# Altium schematic sheet MCU.SchDoc: MCU
size A4; Organization: Zigman NIkita; Address3: zigman.nikita@gmail.com; DocumentNumber: 1.0; Revision: ZN; SheetNumber: 2; SheetTotal: 6
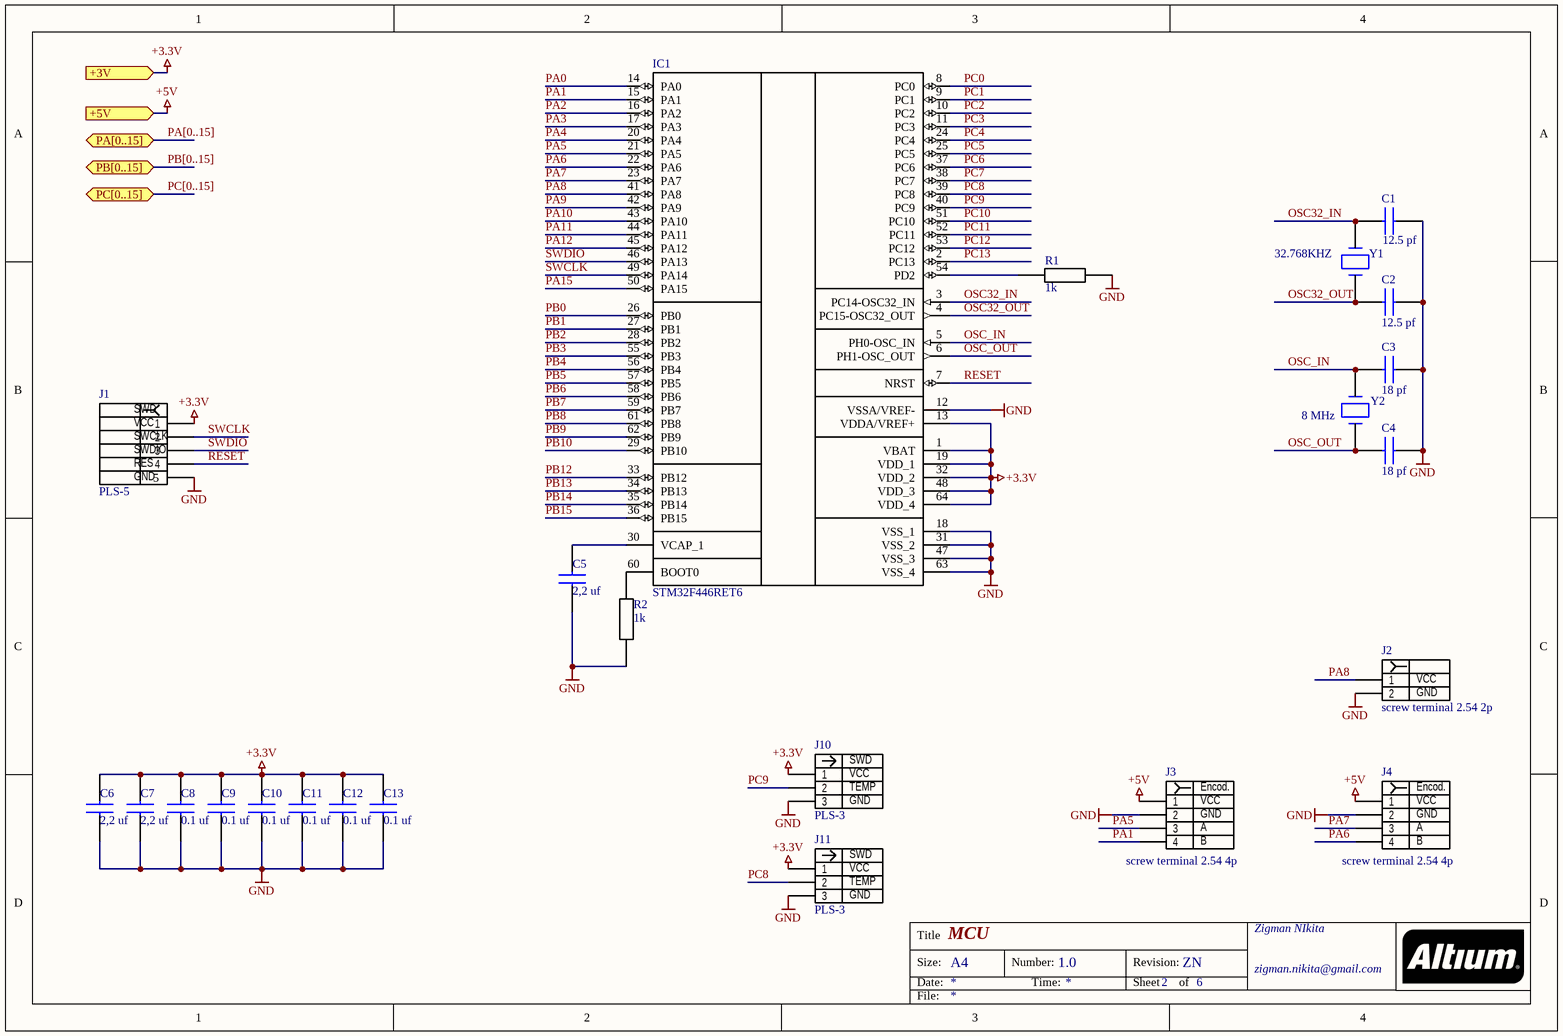
[diagram p0: MCU.SchDoc]

## Parts
C1  12.5 pf  [CAPC1608X90N]
C2  12.5 pf  [CAPC1608X90N]
C3  18 pf  [CAPC1608X90N]
C4  18 pf  [CAPC1608X90N]
C5  2,2 uf  [CAPC1608X90N]
C6  2,2 uf  [CAPC1608X90N]
C7  2,2 uf  [CAPC1608X90N]
C8  0.1 uf  [CAPC1608X90N]
C9  0.1 uf  [CAPC1608X90N]
C10  0.1 uf  [CAPC1608X90N]
C11  0.1 uf  [CAPC1608X90N]
C12  0.1 uf  [CAPC1608X90N]
C13  0.1 uf  [CAPC1608X90N]
IC1  STM32F446RET6  [QFP50P1200X1200X160-64N]
J1  PLS-5  [TE_826646-5]
J2  screw terminal 2.54 2p  [1725672-2-2.54]
J3  screw terminal 2.54 4p  [1725672-4-2.54]
J4  screw terminal 2.54 4p  [1725672-4-2.54]
J10  PLS-3  [TE_826646-3]
J11  PLS-3  [TE_826646-3]
R1  1k  [RESC1608X55N]
R2  1k  [RESC1608X55N]
Y1  32.768KHZ  [9HT1132768KDZBT]
Y2  8 MHz  [ABM2]

## Ports
+3V (in), +5V (in), PA[0..15] (bidir), PB[0..15] (bidir), PC[0..15] (bidir)

## Nets
+3.3V: C6.2 C7.2 C8.2 C9.2 C10.2 C11.2 C12.2 C13.2 IC1.1(VBAT) IC1.13(VDDA/VREF+) IC1.19(VDD_1) IC1.32(VDD_2) IC1.48(VDD_3) IC1.64(VDD_4) J1.1 J10.1 J11.1 ; port +3V
+5V: J3.1 J4.1 ; port +5V
GND: C1.1 C2.1 C3.1 C4.1 C5.1 C6.1 C7.1 C8.1 C9.1 C10.1 C11.1 C12.1 C13.1 IC1.12(VSSA/VREF-) IC1.18(VSS_1) IC1.31(VSS_2) IC1.47(VSS_3) IC1.63(VSS_4) J1.5 J2.2 J3.2 J4.2 J10.3 J11.3 R1.1 R2.2
OSC32_IN: C1.2 IC1.3(PC14-OSC32_IN) Y1.2
OSC32_OUT: C2.2 IC1.4(PC15-OSC32_OUT) Y1.1
OSC_IN: C3.2 IC1.5(PH0-OSC_IN) Y2.2
OSC_OUT: C4.2 IC1.6(PH1-OSC_OUT) Y2.1
PA0: IC1.14(PA0)
PA1: IC1.15(PA1) J3.4
PA2: IC1.16(PA2)
PA3: IC1.17(PA3)
PA4: IC1.20(PA4)
PA5: IC1.21(PA5) J3.3
PA6: IC1.22(PA6) J4.4
PA7: IC1.23(PA7) J4.3
PA8: IC1.41(PA8) J2.1
PA9: IC1.42(PA9)
PA10: IC1.43(PA10)
PA11: IC1.44(PA11)
PA12: IC1.45(PA12)
PA15: IC1.50(PA15)
PB0: IC1.26(PB0)
PB1: IC1.27(PB1)
PB2: IC1.28(PB2)
PB3: IC1.55(PB3)
PB4: IC1.56(PB4)
PB5: IC1.57(PB5)
PB6: IC1.58(PB6)
PB7: IC1.59(PB7)
PB8: IC1.61(PB8)
PB9: IC1.62(PB9)
PB10: IC1.29(PB10)
PB12: IC1.33(PB12)
PB13: IC1.34(PB13)
PB14: IC1.35(PB14)
PB15: IC1.36(PB15)
PC0: IC1.8(PC0)
PC1: IC1.9(PC1)
PC2: IC1.10(PC2)
PC3: IC1.11(PC3)
PC4: IC1.24(PC4)
PC5: IC1.25(PC5)
PC6: IC1.37(PC6)
PC7: IC1.38(PC7)
PC8: IC1.39(PC8) J11.2
PC9: IC1.40(PC9) J10.2
PC10: IC1.51(PC10)
PC11: IC1.52(PC11)
PC12: IC1.53(PC12)
PC13: IC1.2(PC13)
RESET: IC1.7(NRST) J1.4
SWCLK: IC1.49(PA14) J1.2
SWDIO: IC1.46(PA13) J1.3
NetC5_2: C5.2 IC1.30(VCAP_1)
NetIC1_54: IC1.54(PD2) R1.2
NetIC1_60: IC1.60(BOOT0) R2.1

## Buses and harness runs
bus PA[0..15] = port PA[0..15]
bus PB[0..15] = port PB[0..15]
bus PC[0..15] = port PC[0..15]

## Notes on the sheet
- Title
- Size:
- Date:
- A4
- Number:
- Time:
- Revision:
- Sheet
- of
- File:
- (in symbol PLS-3) SWD; VCC; TEMP; GND
- (in symbol PLS-5) SWD; VCC; SWCLK; SWDIO; RES; GND
- (in symbol screw terminal 2.54 2p) VCC; GND
- (in symbol screw terminal 2.54 4p) Encod.; VCC; GND; A; B

## Library data of the parts
C1-C4 = 0603: AVX 18pF 200V dc 0603; Datasheet Link: https://at.rs-online.com/web/p/keramik-vielschichtkondensatoren/6983970/; Height: 0.9mm; Manufacturer_Name: AVX
C5-C7 = 0603: Murata 2.2 uF X7R 10% 10V dc 0603; Manufacturer_Part_Number: 06033C393JAT2A; Datasheet Link: https://at.rs-online.com/web/p/keramik-vielschichtkondensatoren/7235597/; Height: 0.9mm; Manufacturer_Name: Murata
C8-C13 = 0603: AVX 0.1 uF 16v dc 0603; Datasheet Link: https://at.rs-online.com/web/p/keramik-vielschichtkondensatoren/1358340/; Height: 0.9mm; Manufacturer_Name: AVX
IC1 = STM32F446RET6: Integrated Circuit; Manufacturer_Name: STMicroelectronics; Datasheet Link: http://docs-emea.rs-online.com/webdocs/14d7/0900766b814d7c59.pdf; Height: 1.6mm; Manufacturer_Part_Number: STM32F446RET6; Arrow Part Number: STM32F446RET6; Arrow Price/Stock: https://www.arrow.com/en/products/stm32f446ret6/stmicroelectronics; Mouser Part Number: 511-STM32F446RET6; Mouser Price/Stock: https://www.mouser.co.uk/ProductDetail/STMicroelectronics/STM32F446RET6?qs=Ok1pvOkw6%2FqpQsWf8F4wtQ%3D%3D
J1 = PLS-5: Board-To-Board Connector, Through Hole, Header, 5, 2.54 mm, Gold Plated Contacts; MF: TE Connectivity; MP: 826646-5; SnapEDA_Link: https://www.snapeda.com/parts/826646-5/TE%20Connectivity%20AMP%20Connectors/view-part/2389611/?ref=snap; TE_purchase_URL: https://www.te.com/usa-en/product-826646-5.html?te_bu=Cor&te_type=disp&te_campaign=seda_glo_cor-seda-global-disp-prtnr-fy19-seda-model-bom-cta_sma-317_1&elqCampaignId=32493; Availability: Unavailable; Value: *; EU_RoHS_Compliance: Compliant; Price: None; Package: None
J2 = screw terminal 2.54 2p: Connector; Manufacturer_Name: Phoenix Contact; Manufacturer_Part_Number: 1725672; Datasheet Link: https://www.phoenixcontact.com/online/portal/us?uri=pxc-oc-itemdetail:pid=1725672&library=usen&tab=1.pdf; Arrow Part Number: 1725672; Arrow Price/Stock: https://www.arrow.com/en/products/1725672/phoenix-contact; Mouser Part Number: 651-1725672; Mouser Price/Stock: https://www.mouser.co.uk/ProductDetail/Phoenix-Contact/1725672?qs=Ul7CXFMnlWXX93F9bOV2pQ%3D%3D
J3 J4 = screw terminal 2.54 4p: Connector; Manufacturer_Name: Phoenix Contact; Manufacturer_Part_Number: 1725672; Datasheet Link: https://www.phoenixcontact.com/online/portal/us?uri=pxc-oc-itemdetail:pid=1725672&library=usen&tab=1.pdf; Arrow Part Number: 1725672; Arrow Price/Stock: https://www.arrow.com/en/products/1725672/phoenix-contact; Mouser Part Number: 651-1725672; Mouser Price/Stock: https://www.mouser.co.uk/ProductDetail/Phoenix-Contact/1725672?qs=Ul7CXFMnlWXX93F9bOV2pQ%3D%3D
J10 J11 = PLS-3: Board-To-Board Connector, Through Hole, Header, 5, 2.54 mm, Gold Plated Contacts; MF: TE Connectivity; MP: 826646-5; SnapEDA_Link: https://www.snapeda.com/parts/826646-5/TE%20Connectivity%20AMP%20Connectors/view-part/2389611/?ref=snap; TE_purchase_URL: https://www.te.com/usa-en/product-826646-5.html?te_bu=Cor&te_type=disp&te_campaign=seda_glo_cor-seda-global-disp-prtnr-fy19-seda-model-bom-cta_sma-317_1&elqCampaignId=32493; Availability: Unavailable; Value: *; EU_RoHS_Compliance: Compliant; Price: None; Package: None
R1 R2 = res 0603: RS PRO SMD-Widerstand, 1kΩ ±5%; Manufacturer_Name: RS PRO; Datasheet Link: https://at.rs-online.com/web/p/smd-widerstande/7134141/; Height: 0.55mm
Y1 = CM7V-T1A 32.768KHZ: Quarz CM7V-T1A 32.768KHZ 7PF +/-20PPM TB QA 32.768kHz, ±20ppm; Manufacturer_Name: CM7V; Datasheet Link: https://at.rs-online.com/web/p/schwingquarz/1735831/; Height: 0.6mm; Manufacturer_Part_Number: CM7V-T1A
Y2 = ABM2-8.000MHZ-D4Y-T: Quarz ABM2-8.000MHZ-D4Y-T 8MHz, ±30ppm; Manufacturer_Name: ABM; Datasheet Link: https://at.rs-online.com/web/p/schwingquarz/1710612/; Height: 1.6 mm; Manufacturer_Part_Number: ABM2-8.000MHZ-D4Y-T